# EAGLE design bottom_PCB_mini (EAGLE 8.1.1)
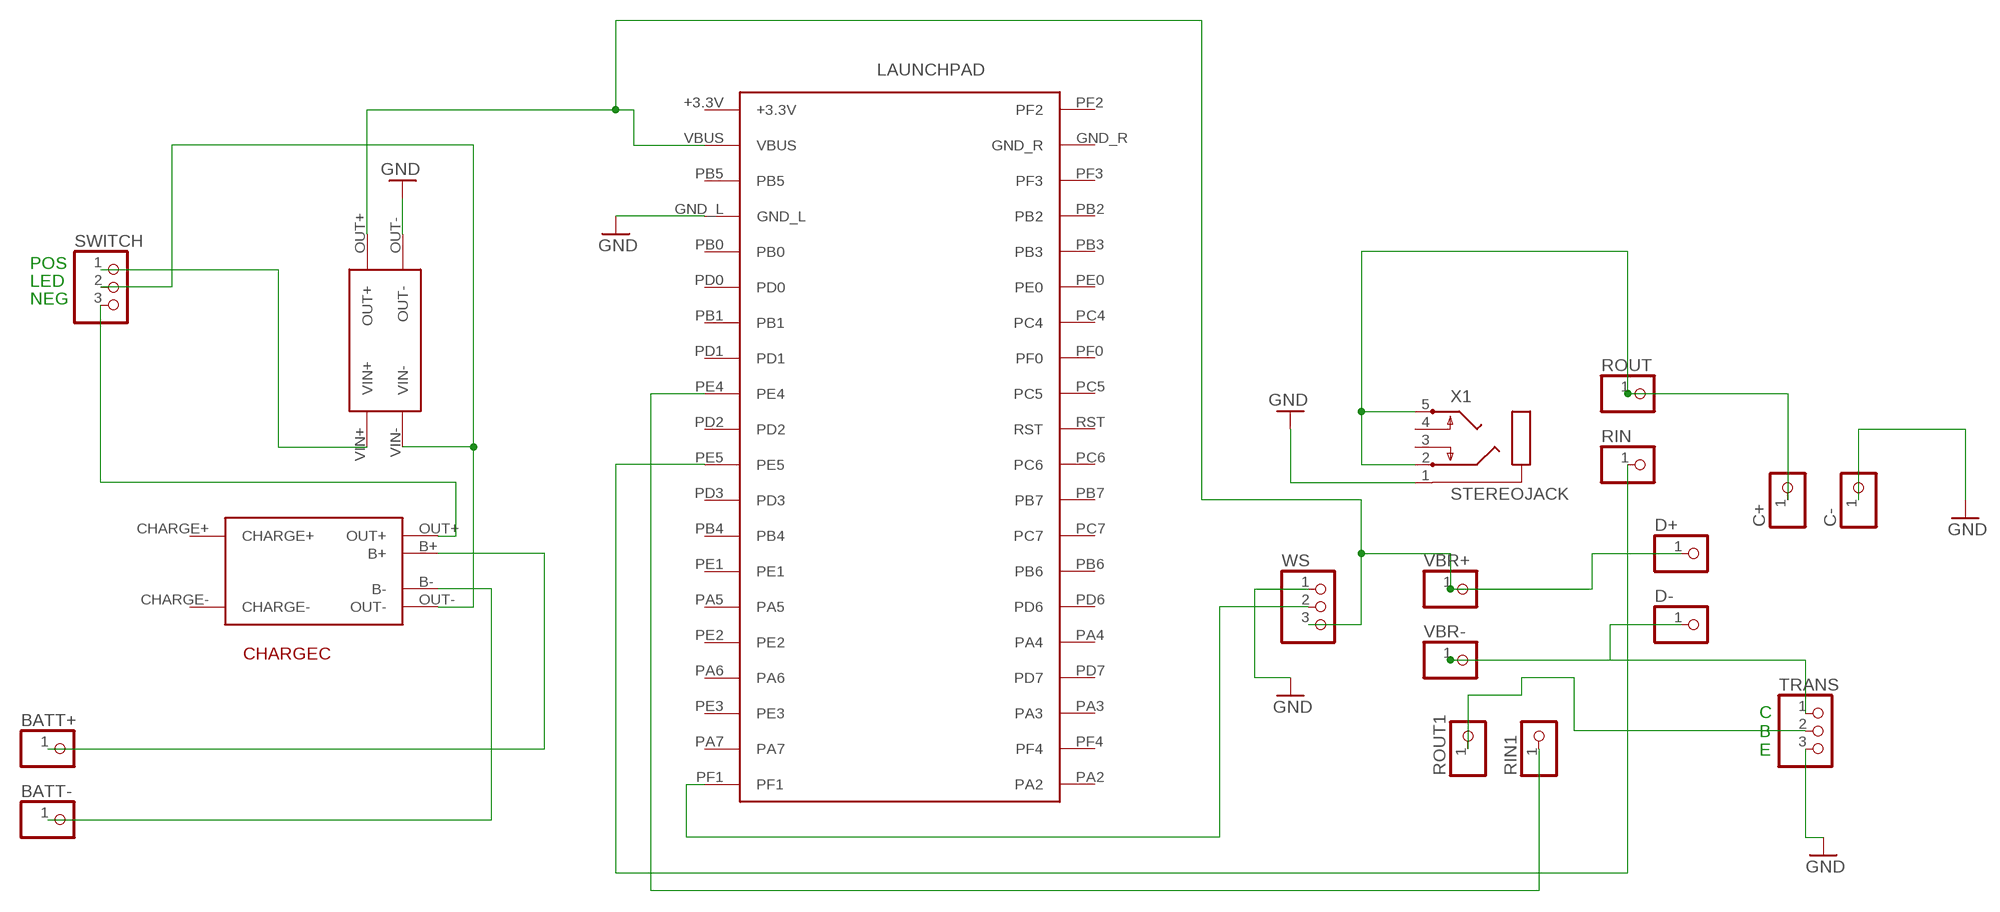
[diagram p0: schematic, sheet 1]

## Parts
BATT+  PINHD-1X1CB  [1X01-CLEANBIG]
BATT-  PINHD-1X1CB  [1X01-CLEANBIG]
C+  PINHD-1X1CB  [1X01-CLEANBIG]
C-  PINHD-1X1CB  [1X01-CLEANBIG]
CHARGEC  18650CCEBAY  [18650CCEBAY]
D+  PINHD-1X1CB  [1X01-CLEANBIG]
D-  PINHD-1X1CB  [1X01-CLEANBIG]
LAUNCHPAD  TM4CTM4C  [1_05X2MM]
RIN  PINHD-1X1CB  [1X01-CLEANBIG]
RIN1  PINHD-1X1CB  [1X01-CLEANBIG]
ROUT  PINHD-1X1CB  [1X01-CLEANBIG]
ROUT1  PINHD-1X1CB  [1X01-CLEANBIG]
SWITCH  PINHD-1X3CB  [1X03-CLEANBIG]
TRANS  PINHD-1X3CB  [1X03-CLEANBIG]
VBR+  PINHD-1X1CB  [1X01-CLEANBIG]
VBR-  PINHD-1X1CB  [1X01-CLEANBIG]
VREG  MT3608_EBAY  [MT3608_EBAY]
WS  PINHD-1X3CB  [1X03-CLEANBIG]
X1  STEREOJACK  [STX3100]

## Nets
GND: C-.1 LAUNCHPAD.GND_L TRANS.3 VREG.OUT- WS.1 X1.1
N$1: BATT-.1 CHARGEC.B-
N$2: BATT+.1 CHARGEC.B+
N$3: CHARGEC.OUT- SWITCH.2 VREG.VIN-
N$5: CHARGEC.OUT+ SWITCH.3
N$6: SWITCH.1 VREG.VIN+
N$7: C+.1 ROUT.1 X1.2 X1.5
N$8: D+.1 LAUNCHPAD.VBUS VBR+.1 VREG.OUT+ WS.3
N$9: LAUNCHPAD.PF1 WS.2
N$10: LAUNCHPAD.PE5 RIN.1
N$11: LAUNCHPAD.PE4 RIN1.1
N$12: ROUT1.1 TRANS.2
N$13: D-.1 TRANS.1 VBR-.1
Unconnected: CHARGEC.CHARGE+ CHARGEC.CHARGE- LAUNCHPAD.PA2 LAUNCHPAD.PA3 LAUNCHPAD.PA4 LAUNCHPAD.PA5 LAUNCHPAD.PA6 LAUNCHPAD.PA7 LAUNCHPAD.PB0 LAUNCHPAD.PB1 LAUNCHPAD.PB2 LAUNCHPAD.PB3 LAUNCHPAD.PB4 LAUNCHPAD.PB5 LAUNCHPAD.PB6 LAUNCHPAD.PB7 LAUNCHPAD.PC4 LAUNCHPAD.PC5 LAUNCHPAD.PC6 LAUNCHPAD.PC7 LAUNCHPAD.PD0 LAUNCHPAD.PD1 LAUNCHPAD.PD2 LAUNCHPAD.PD3 LAUNCHPAD.PD6 LAUNCHPAD.PD7 LAUNCHPAD.PE0 LAUNCHPAD.PE1 LAUNCHPAD.PE2 LAUNCHPAD.PE3 LAUNCHPAD.PF0 LAUNCHPAD.PF2 LAUNCHPAD.PF3 LAUNCHPAD.PF4 LAUNCHPAD.RST X1.3 X1.4

## Notes on the sheet
- POS
- LED
- NEG
- C
  B
  E

## Power pins joined to a net without a drawn wire
+3.3V: LAUNCHPAD.+3.3V
GND_R: LAUNCHPAD.GND_R

## Library data of the parts
BATT+ BATT- C+ C- D+ D- RIN RIN1 ROUT ROUT1 VBR+ VBR- = adafruit:PINHD-1X1: Pin header 1x1 for 0.1" spacing With round pins
CHARGEC = 18650ChargeCircuit:18650CCEBAY: Device for this (http://www.ebay.com/itm/172158430467?_trksid=p2060353.m2749.l2649&ssPageName=STRK%3AMEBIDX%3AIT)
LAUNCHPAD = TM4C:TM4C: Tiva TM4C Lauchpad. Untested.
SWITCH TRANS WS = adafruit:PINHD-1X3: PIN HEADER
VREG = MT3608:MT3608_EBAY
X1 = adafruit:STEREOJACK: MIC/HEADPHONE JACK Stereo jack with two switches. Kycon STX3100, CUI SJ1-3555NG and/or 4UCon 05544

## Board
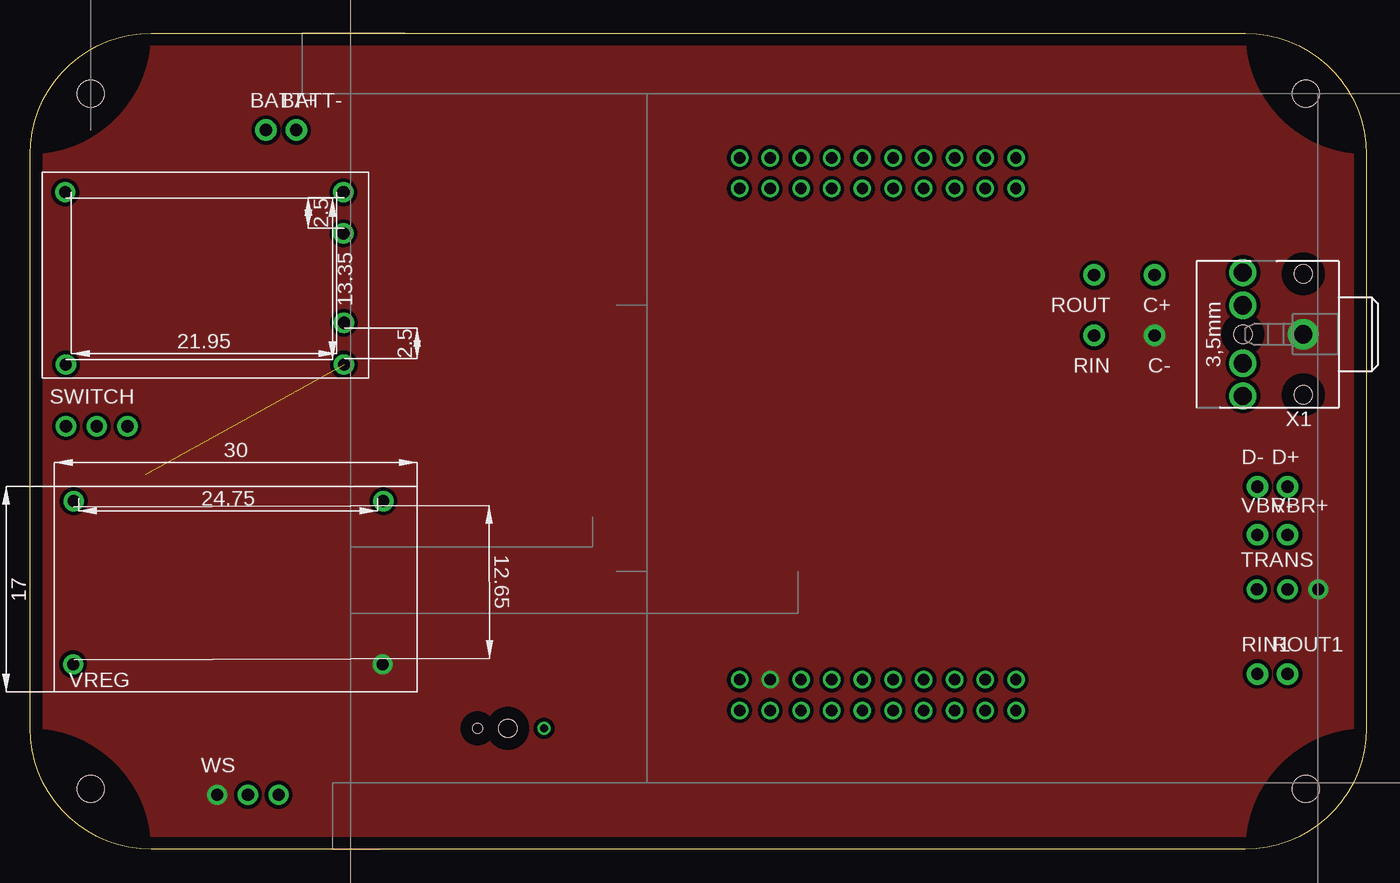
[diagram p1: board, top side]
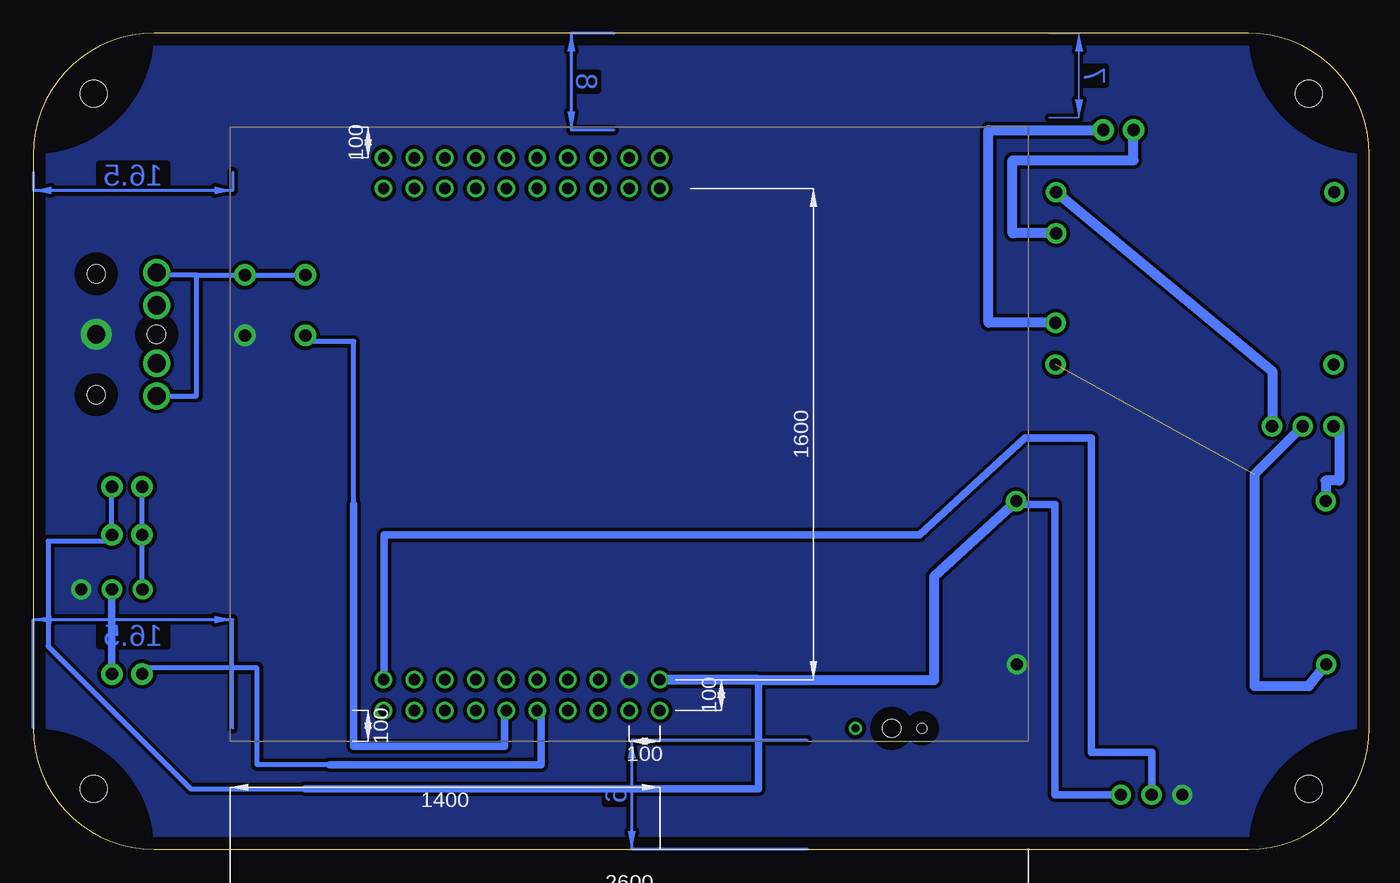
[diagram p2: board, bottom side, seen from below]

Size 110.5 x 67.5 mm. Coordinates in mm from the lower left corner, seen from the top.
Outline: 0,57.5 arc-90 10,67.5 100.5,67.5 arc-90 110.5,57.5 110.5,10 arc-90 100.5,0 10,0 arc-90 0,10 0,57.5
Copper layers (1*16): Top 0.035mm / dielectric 1.5mm / Bottom 0.035mm
Design rules "default": minimum track width 10mil, minimum drill 24mil, track to track 8mil, track to pad 8mil, pad to pad 8mil, via to via 8mil, smd to smd 8mil, copper to edge 40mil, drill to drill 8mil, minimum pad ring 10mil, minimum via ring 8mil, stop-mask expansion 4mil, vias tented up to drill 0mil, thermal gap 10mil
Holes 2.2 mm at 5,5 5,62.5 105.5,62.5 105.5,5
Holes 1.5 mm at 39.5,10
Holes 0.8 mm at 37,10

### Footprints (pad centres in the part's own frame; a part is rotated, then mirrored left to right if it is on the bottom)
1X01-CLEANBIG = drill 1.016 pad 1.778: 1 0,0
18650CCEBAY = drill 1 pad 1.676: B+ 14.9,1.95; B- 14.95,-5.45; CHARGE+ -8.1,5.35; CHARGE- -8.05,-8.9; OUT+ 14.9,5.35; OUT- 14.95,-8.9
1_05X2MM = drill 0.94: +3.3V -7.62,8.89; GND_L -10.16,6.35; GND_R -53.34,8.89; PA2 -53.34,-13.97; PA3 -53.34,-11.43; PA4 -53.34,-8.89; PA5 -7.62,-8.89; PA6 -7.62,-11.43; PA7 -7.62,-13.97; PB0 -7.62,3.81; PB1 -7.62,1.27; PB2 -53.34,6.35; PB3 -50.8,3.81; PB4 -7.62,-6.35; PB5 -7.62,6.35; PB6 -53.34,-6.35; PB7 -53.34,-3.81; PC4 -50.8,1.27; PC5 -50.8,-1.27; PC6 -50.8,-3.81; PC7 -50.8,-6.35; PD0 -10.16,3.81; PD1 -10.16,1.27; PD2 -10.16,-1.27; PD3 -10.16,-3.81; PD6 -50.8,-8.89; PD7 -50.8,-11.43; PE0 -53.34,3.81; PE1 -10.16,-6.35; PE2 -10.16,-8.89; PE3 -10.16,-11.43; PE4 -7.62,-1.27; PE5 -7.62,-3.81; PF0 -53.34,1.27; PF1 -10.16,-13.97; PF2 -50.8,8.89; PF3 -50.8,6.35; PF4 -50.8,-13.97; RST -53.34,-1.27; VBUS -10.16,8.89
1X03-CLEANBIG = drill 1.016 pad 1.676: 1 -2.54,0; 2 0,0; 3 2.54,0
MT3608_EBAY = drill 1 pad 1.676: OUT+ 22.2,7.8; OUT- 22.15,-5.7; VIN+ -3.4,7.8; VIN- -3.45,-5.7
STX3100 = drill 1.5 pad 2.54: 1 2.7,-0.1 | drill 1.5: 2 7.7,5; 3 7.7,2.3; 4 7.7,-2.5; 5 7.7,-5.2 | hole 1.5: 2.7,4.9; 2.7,-5.1; 7.7,-0.1

### Placement (x,y rotation side)
BATT+  19.5,59.5 0 top
BATT-  22,59.5 0 top
C+  93,47.5 180 top
C-  93,42.5 180 top
CHARGEC  11,49 0 top
D+  104,30 0 top
D-  101.5,30 0 top
LAUNCHPAD  67.56,3.86 270 bottom
RIN  88,42.5 180 top
RIN1  101.5,14.5 0 top
ROUT  88,47.5 180 top
ROUT1  104,14.5 0 top
SWITCH  5.5,35 0 top
TRANS  104,21.5 0 top
VBR+  104,26 0 top
VBR-  101.5,26 0 top
VREG  7,21 0 top
WS  18,4.5 0 top
X1  108,42.5 180 top

### Tracks (layer width: path | path; a pad name or v marks a point on that pad's centre or on a via)
GND
  pour Bottom (isolate 0.305, no thermals): 10,67.5 arc-90 0,57.5 0,10 arc-90 10,0 100.5,0 arc-90 110.5,10 110.5,57.5 arc-90 100.5,67.5
  pour Top (isolate 0.305, no thermals): 10,67.5 arc-90 0,57.5 0,10 arc-90 10,0 100.5,0 arc-90 110.5,10 110.5,57.5 arc-90 100.5,67.5
N$1
  Bottom 0.813: CHARGEC.B- 31.5,43.55 31.5,59.5 BATT-.1
N$2
  Bottom 0.813: CHARGEC.B+ 29.5,50.95 29.5,57 19.5,57 BATT+.1
N$3  (1 unrouted)
  Bottom 0.813: VREG.VIN- 5,13.5 9.5,13.5 9.5,31 SWITCH.2 | CHARGEC.OUT- 26,40.1
N$4  (via drill 0.7)
  other vias: 42.5,10
N$5
  Bottom 0.813: CHARGEC.OUT+ 8,39.5 8.04,39.5 SWITCH.3
N$6
  Bottom 0.813: SWITCH.1 2.5,35 2.5,30.5 3.6,30.5 VREG.VIN+
N$7
  Bottom 0.406: X1.2 97,37.5 97,47.5 | 97,47.5 100.3,47.5 X1.5 | ROUT.1 C+.1 97,47.5
N$8
  Bottom 0.406: D+.1 VBR+.1 104,25.5 109.28,25.5 109.28,16.78 97.5,5 88,5
  Bottom 0.61: 88,5 50.5,5 50.5,14 | WS.3 26,4.5 26,28.5 29.2,28.5 VREG.OUT+
  Bottom 0.813: VREG.OUT+ 36,22.55 36,14 50.5,14 58.67,14 LAUNCHPAD.VBUS
N$9
  Bottom 0.406: 81.53,14 LAUNCHPAD.PF1
  Bottom 0.61: LAUNCHPAD.PF1 81.5,14.02 81.5,26 37.2,26 28.5,34 23,34 23,8 18,8 WS.2
N$10
  Bottom 0.406: 84,28.5 84,42 88,42 RIN.1
  Bottom 0.61: LAUNCHPAD.PE5 71.5,11.48 71.5,8.5 84,8.5 84,28.5
N$11
  Bottom 0.406: 86,7 92,7 92,15 101.5,15 RIN1.1
  Bottom 0.61: LAUNCHPAD.PE4 68.5,11.48 68.5,7 86,7
N$12
  Bottom 0.61: ROUT1.1 TRANS.2
N$13
  Bottom 0.406: D-.1 VBR-.1 101.5,21.5 TRANS.1
(copper drawn outside any net)
  shapes: Bottom area x5